# Altium schematic sheet Supply.SchDoc
size Letter
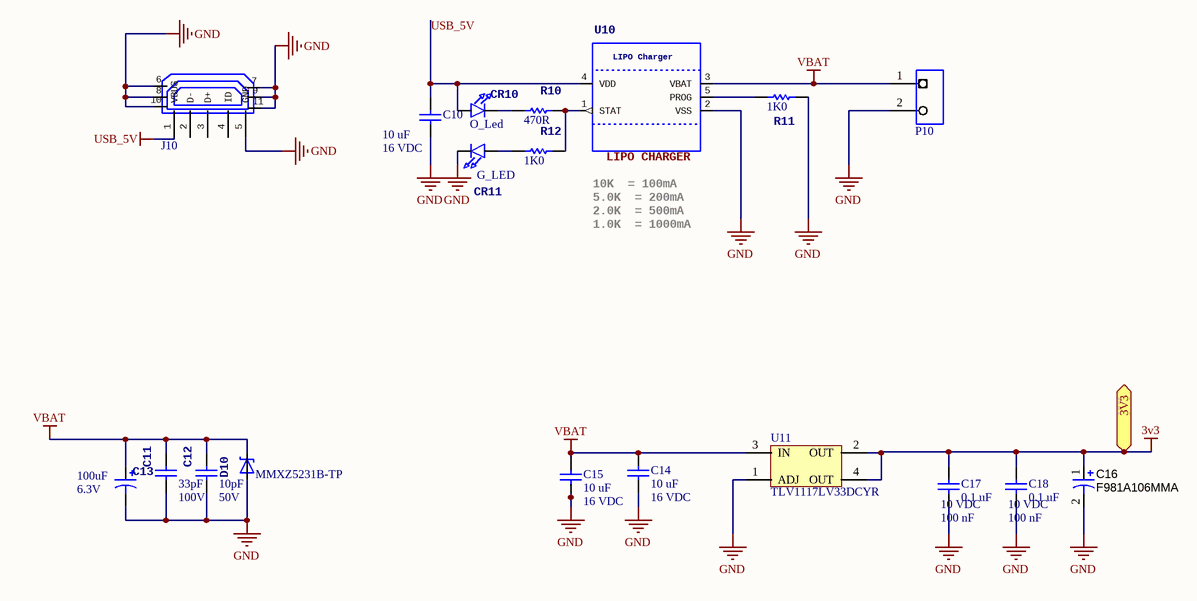
[diagram p0: Supply.SchDoc]

## Parts
C10  Capacitance: 10 uF  Voltage Rating DC: 16 VDC  [C0603]  (hidden comment: EMK107BBJ106MA-T)
C11  Capacitance: 33pF  Voltage Rating: 100V  [0805-C]  (hidden comment: 08051A330JAT2A)
C12  Capacitance: 10pF  Voltage Rating: 50V  [0805-C]  (hidden comment: 04025A100JAT2A)
C13  Capacitance: 100uF  Voltage Rating: 6.3V  [C1210]  (hidden comment: C3225X6S0J107M250AC)
C14  Capacitance: 10 uF  Voltage Rating DC: 16 VDC  [C0603]  (hidden comment: EMK107BBJ106MA-T)
C15  Capacitance: 10 uF  Voltage Rating DC: 16 VDC  [C0603]  (hidden comment: EMK107BBJ106MA-T)
C16  F981A106MMA  [C0603_P]
C17  Capacitance: 0.1 uF  Voltage Rating DC: 10 VDC  Capacitance - nF: 100 nF  [C0402]  (hidden comment: 100 nF, 10 V)
C18  Capacitance: 0.1 uF  Voltage Rating DC: 10 VDC  Capacitance - nF: 100 nF  [C0402]  (hidden comment: 100 nF, 10 V)
CR10  Product: O_Led  [0402-LED_RED]  (hidden comment: Led_Orange_0402)
CR11  Product: G_LED  [0402-LED_GRE]  (hidden comment: SML-P11MTT86R)
D10  Manufacturer Part Number: MMXZ5231B-TP  [SOD-123]  (hidden comment: MMSZ5231BT1G)
J10  1981568-1  [TYCO_19815681N]  (value not drawn)
P10  header  [HDR1X2]  (value not drawn)
R10  Resistance: 470R  [0805-R]  (hidden comment: CRCW0805470RJNEA)
R11  Resistance: 1K0  [0805-R]  (hidden comment: CRCW08051K00JNEB)
R12  Resistance: 1K0  [0805-R]  (hidden comment: CRCW08051K00JNEB)
U10  MCP73831T-2ACI/OT  [SOT23-5]  (value not drawn)
U11  TLV1117LV33DCYR  [SOT230P700X180-4AN]

## Ports
3V3 (out)

## Nets
3v3: C16.1(+) C17.1 C18.1 U11.2(OUT) U11.4(OUT) ; port 3V3
GND: C10.2 C11.2 C12.2 C13.2(-) C14.2 C15.2 C16.2(-) C17.2 C18.2 CR11.K D10.A J10.5(GND) J10.6 J10.7 J10.8 J10.9 J10.10 J10.11 P10.2 R11.2 U10.2(VSS) U11.1(ADJ)
USB_5V: C10.1 CR10.A J10.1(VBUS) U10.4(VDD)
VBAT: C11.1 C12.1 C13.1(+) C14.1 C15.1 D10.C P10.1 U10.3(VBAT) U11.3(IN)
NetCR10_K: CR10.K R10.1
NetCR11_A: CR11.A R12.1
NetR10_2: R10.2 R12.2 U10.1(STAT)
NetR11_1: R11.1 U10.5(PROG)

Not connected (* = marked no-connect by the designer): J10 2(D-) 3(D+) 4(ID)

## Notes on the sheet
- LIPO CHARGER
- 10K  = 100mA
- 5.0K  = 200mA
- 2.0K  = 500mA
- 1.0K  = 1000mA
- Proyecto:
- CENTRO DE INGENIERIA Y DESARROLLO INDUSTRIAL
- Titulo:
- Fecha:
- Hoja:
- Elaborado por:
- de
- Hora:
- Revisión:
- Revisado por:
- CIDESI_template_letter

## Library data of the parts
C10 C14 C15 = 10 uF, 16 V: Cap_Cer; Manufacturer: Taiyo Yuden; Tolerance: 20 %; Type: General Purpose; Class: Class 2; Dielectric: X5R; Supplier 1: Mouser; Manufacturer Part Number: EMK107BBJ106MA-T; RoHS: RoHS Compliant; Category: Multilayer Ceramic Capacitors MLCC - SMD/SMT; Stock 1: 78303; Pricing 1: 1=0.530, 10=0.278, 100=0.163, 500=0.126, 1000=0.100, 4000=0.100 (USD); Diameter: -; Height: 0.8 mm; Length: 1.6 mm; Package / Case: 0603 (1608 metric); Packaging: Reel; Product: General Type MLCCs; Series: M; Termination Style: SMD/SMT; Width: 0.8 mm; Brand: Taiyo Yuden; Case Code - in: 0603; Case Code - mm: 1608; Maximum Operating Temperature: + 85 C; Minimum Operating Temperature: - 55 C; Standard Pack Qty: 4000; Termination: -; RoHS - Mouser: Y; Minimum Order Quantity: 1; Reeling: True; ComponentLink1URL: http://www.mouser.com/ds/2/396/mlcc11_hq_e-541564.pdf; ComponentLink1Description: http://www.mouser.com/ds/2/396/mlcc11_hq_e-541564.pdf; Supplier Part Number 1: 963-EMK107BBJ106MA-T
C11 = 33pF, 100V: Cap_Cer; Manufacturer: AVX; Ceramic Capacitor Case: 0805 [2012 Metric]; Capacitance Tolerance: 5%; Dielectric Characteristic: C0G / NP0; Supplier 1: Newark; Manufacturer Part Number: 08051A330JAT2A; RoHS: YES; Stock 1: 2874; Pricing 1: 1=0.012, 25=0.012, 50=0.012, 100=0.012, 250=0.012, 500=0.012, 1000=0.012, 2500=0.012 (USD); Product Range: -; Packaging: Cut Tape; ComponentLink1URL: http://www.avx.com/docs/Catalogs/cpack.pdf; ComponentLink1Description: http://www.avx.com/docs/Catalogs/cpack.pdf; ComponentLink2URL: http://www.farnell.com/cad/1614359.zip; ComponentLink2Description: http://www.farnell.com/cad/1614359.zip; ComponentLink3URL: http://www.farnell.com/datasheets/2068140.pdf; ComponentLink3Description: http://www.farnell.com/datasheets/2068140.pdf; Supplier Part Number 1: 96K4771
C12 = 10pF, 50V: Cap_Cer; Manufacturer: AVX; Ceramic Capacitor Case: 0402 [1005 Metric]; Capacitance Tolerance: 5%; Dielectric Characteristic: C0G / NP0; Supplier 1: Newark; Manufacturer Part Number: 04025A100JAT2A; RoHS: YES; Stock 1: 235697; Pricing 1: 1=0.003, 25=0.003, 100=0.003, 250=0.003, 500=0.003, 1000=0.003, 2500=0.003 (USD); Product Range: -; Packaging: Cut Tape; ComponentLink1URL: http://www.farnell.com/datasheets/2068140.pdf; ComponentLink1Description: http://www.farnell.com/datasheets/2068140.pdf; Supplier Part Number 1: 96M1128
C13 = 100uF, 6.3V: Cap_Pol; Manufacturer: TDK; Ceramic Capacitor Case: 1210 [3225 Metric]; Capacitance Tolerance: 20%; Dielectric Characteristic: X6; Product Range: C Series; Supplier 1: Newark; Manufacturer Part Number: C3225X6S0J107M250AC; RoHS: YES; Stock 1: 1165; Pricing 1: 1=2.09, 10=1.72, 25=1.48, 50=1.24, 100=1.01, 250=0.95, 500=0.897 (USD); Packaging: Cut Tape; ComponentLink1URL: http://bcove.me/dwwzmldz; ComponentLink1Description: http://bcove.me/dwwzmldz; ComponentLink2URL: http://www.farnell.com/datasheets/2291921.pdf; ComponentLink2Description: http://www.farnell.com/datasheets/2291921.pdf; Supplier Part Number 1: 78Y7998
C16 = 10UF, 10V, C_TAN: CAP_TAN; Manufacturer 1: NICHICON; Value: 10 uF; Product Range: NICHICON - F98 Series; Capacitance: 10; Capacitance Tolerance: ± 20%; Capacitor Case Style: 0603 ^1608 Metric]; ESR: 7.5; Description 1: NICHICON - F981A106MMA - CAPACITOR TANT, 10UF, 10V 20%; Supplier 1: Farnell; Stock 1: 9201; Pricing 1: 1=0.282, 10=0.236, 100=0.169, 250=0.148, 500=0.131, 1000=0.117 (GBP); Voltage Rating: 10; Operating Temperature Max: 125; Series: F98; ComponentLink1URL: http://www.nichicon.co.jp/english/products/pdfs/e-f98.pdf; ComponentLink1Description: http://www.nichicon.co.jp/english/products/pdfs/e-f98.pdf; Supplier Part Number 1: 1853431; Manufacturer Part Number 1: F981A106MMA; RoHS 1: YES; Manufacturer Part Number: F981A106MMA
C17 C18 = 100 nF, 10 V: Cap_Cer; Manufacturer: Murata Electronics; Manufacturer Part Number: GRM155R71A104KA01D; Tolerance: 10 %; Type: General Purpose MLCC; Capacitance - pF: 100000 pF; Dielectric: X7R; Qualification: Commercial; Supplier 1: Mouser; RoHS: RoHS Compliant; Stock 1: 259611; Pricing 1: 1=0.100, 10=0.006, 100=0.004, 500=0.003, 10000=0.003 (USD); Packaging: Reel; ComponentLink1URL: http://www.mouser.com/ds/2/281/c02e-2905.pdf; ComponentLink1Description: http://www.mouser.com/ds/2/281/c02e-2905.pdf; Supplier Part Number 1: 81-GRM155R71A104KA1D; Category: Multilayer Ceramic Capacitors MLCC - SMD/SMT; Height: 0.5 mm; Length: 1 mm; Package / Case: 0402 (1005 metric); Product: General Type MLCCs; Series: GRM; Termination Style: SMD/SMT; Width: 0.5 mm; Brand: Murata Electronics; Case Code - in: 0402; Case Code - mm: 1005; Maximum Operating Temperature: + 125 C; Minimum Operating Temperature: - 55 C; Standard Pack Qty: 10000; RoHS - Mouser: Y; Minimum Order Quantity: 1; Reeling: True
CR10 = Led_Orange_0402: Led_Orange; Manufacturer: ROHM Semiconductor; Manufacturer Part Number: SML-P12DTT86R; Illumination Color: Orange; Luminous Intensity: 100 mcd; If - Forward Current: 20 mA; Lens Transparency: Water Clear; Vf - Forward Voltage: 2.1 V; Wavelength/Color Temperature: 605 nm; Supplier 1: Mouser; RoHS: RoHS Compliant; Category: Standard LEDs - SMD; Stock 1: 22469; Pricing 1: 1=0.546, 10=0.347, 100=0.150, 1000=0.114, 5000=0.087 (MXN); Length: 1 mm; Orientation: Top View; Package / Case: 0402 (1005 metric); Packaging: Cut Tape; Series: SML-P1x; Width: 0.6 mm; Brand: ROHM Semiconductor; Mounting Style: SMD/SMT; Viewing Angle: -; Maximum Operating Temperature: + 85 C; Minimum Operating Temperature: - 40 C; Moisture Sensitive: Yes; Product Type: LED - Standard; Standard Pack Qty: 5000; Subcategory: LEDs; Tradename: PICOLED; RoHS - Mouser: Y; Minimum Order Quantity: 1; Reeling: True; ComponentLink1URL: https://www.mouser.com/datasheet/2/348/sml-p1-e-1809025.pdf; ComponentLink1Description: https://www.mouser.com/datasheet/2/348/sml-p1-e-1809025.pdf; Supplier Part Number 1: 755-SML-P12DTT86R
CR11 = Led_Green_0402: Led_Green; Manufacturer: ROHM Semiconductor; Illumination Color: Green; Luminous Intensity: 2.1 mcd; If - Forward Current: 1 mA; Lens Transparency: Water Clear; Vf - Forward Voltage: 1.9 V; Wavelength/Color Temperature: 569 nm; Supplier 1: Mouser; Manufacturer Part Number: SML-P11MTT86R; RoHS: RoHS Compliant; Category: Standard LEDs - SMD; Stock 1: 15242; Pricing 1: 1=0.585, 10=0.376, 100=0.161, 1000=0.124, 5000=0.094 (MXN); Length: 1 mm; Orientation: Top View; Package / Case: 0402 (1006 metric); Packaging: Cut Tape; Series: SML-P11; Width: 0.6 mm; Brand: ROHM Semiconductor; Mounting Style: SMD/SMT; Viewing Angle: -; Maximum Operating Temperature: + 85 C; Minimum Operating Temperature: - 40 C; Moisture Sensitive: Yes; Product Type: LED - Standard; Standard Pack Qty: 5000; Subcategory: LEDs; Tradename: PICOLED; RoHS - Mouser: Y; Minimum Order Quantity: 1; Reeling: True; ComponentLink1URL: https://www.mouser.com/datasheet/2/348/sml-p11-e-1139217.pdf; ComponentLink1Description: https://www.mouser.com/datasheet/2/348/sml-p11-e-1139217.pdf; Supplier Part Number 1: 755-SML-P11MTT86R
D10 = Diode_Zener: Manufacturer: MICRO COMMERCIAL COMPONENTS; Zener Voltage Vz Typ: 5.1; Power Dissipation Pd: 200; Diode Case Style: SOD-323; Zener Tolerance: 5%; No. of Pins: 2; Supplier 1: Newark; RoHS: YES; Stock 1: 410; Pricing 1: 1=0.602, 10=0.434, 100=0.256, 250=0.181, 500=0.139, 1000=0.098, 5000=0.082, 10000=0.07 (USD); Operating Temperature Max: 150 C; Product Range: -; Packaging: Cut Tape; ComponentLink1URL: http://61.222.192.61/mccsemi/up_pdf/Product%20Packaging.pdf; ComponentLink1Description: http://61.222.192.61/mccsemi/up_pdf/Product%20Packaging.pdf; ComponentLink2URL: http://www.farnell.com/datasheets/1699886.pdf; ComponentLink2Description: http://www.farnell.com/datasheets/1699886.pdf; Supplier Part Number 1: 51T4940
J10 = USB: Micro USB; Manufacturer: AMP - TE CONNECTIVITY; Supplier 1: Newark; Manufacturer Part Number: 1981568-1; Stock 1: 1013; Pricing 1: 1=1.39, 10=1.39, 25=1.39, 50=1.29, 100=1.29, 250=1.29, 500=1.29 (USD); ComponentLink1URL: http://www.farnell.com/datasheets/1650952.pdf; ComponentLink1Description: http://www.farnell.com/datasheets/1650952.pdf; ComponentLink2URL: http://www.farnell.com/datasheets/1654342.pdf; ComponentLink2Description: http://www.farnell.com/datasheets/1654342.pdf; ComponentLink3URL: http://www.farnell.com/cad/1957472.pdf; ComponentLink3Description: http://www.farnell.com/cad/1957472.pdf; ComponentLink4URL: https://players.brightcove.net/1362235890001/BJ9h2Pe9_default/index.html?videoId=5970358614001; ComponentLink4Description: https://players.brightcove.net/1362235890001/BJ9h2Pe9_default/index.html?videoId=5970358614001; ComponentLink5URL: https://players.brightcove.net/1362235890001/BJ9h2Pe9_default/index.html?videoId=5970358640001; ComponentLink5Description: https://players.brightcove.net/1362235890001/BJ9h2Pe9_default/index.html?videoId=5970358640001; ComponentLink6URL: https://players.brightcove.net/1362235890001/BJ9h2Pe9_default/index.html?videoId=5970356014001; ComponentLink6Description: https://players.brightcove.net/1362235890001/BJ9h2Pe9_default/index.html?videoId=5970356014001; Supplier Part Number 1: 73M8666
P10 = header: Bateria; Manufacturer Part Number: No aplica
R10 = 470R0, 125mW: Resistor; Manufacturer: VISHAY; Supplier 1: Newark; Manufacturer Part Number: CRCW0805470RJNEA; RoHS: YES; Stock 1: 1520; Pricing 1: 1=0.131, 25=0.055, 50=0.043, 100=0.032, 250=0.032, 500=0.03, 1000=0.023 (USD); ComponentLink1URL: http://www.vishay.com/docs/20014/smdpack.pdf; ComponentLink1Description: http://www.vishay.com/docs/20014/smdpack.pdf; ComponentLink2URL: http://www.farnell.com/cad/1552941.zip; ComponentLink2Description: http://www.farnell.com/cad/1552941.zip; ComponentLink3URL: http://www.farnell.com/datasheets/2111203.pdf?_ga=1.39057253.733356815.1493180800; ComponentLink3Description: http://www.farnell.com/datasheets/2111203.pdf?_ga=1.39057253.733356815.1493180800; Supplier Part Number 1: 59M8584
R11 R12 = 1K0, 125mW: Resistor; Manufacturer: VISHAY; Voltage Rating: 150V; Resistor Case Style: 0805 [2012 Metric]; Power Rating: 125; Resistance Tolerance: 5%; Product Range: CRCW Series; Supplier 1: Newark; Manufacturer Part Number: CRCW08051K00JNEB; RoHS: YES; Stock 1: 2322; Pricing 1: 1=0.004, 25=0.004, 100=0.004 (USD); Packaging: Cut Tape; MSL: MSL 1 - Unlimited; ComponentLink1URL: http://www.vishay.com/docs/20014/smdpack.pdf; ComponentLink1Description: http://www.vishay.com/docs/20014/smdpack.pdf; ComponentLink2URL: http://www.farnell.com/cad/1552627.zip; ComponentLink2Description: http://www.farnell.com/cad/1552627.zip; ComponentLink3URL: http://www.farnell.com/datasheets/2111203.pdf?_ga=1.39057253.733356815.1493180800; ComponentLink3Description: http://www.farnell.com/datasheets/2111203.pdf?_ga=1.39057253.733356815.1493180800; Supplier Part Number 1: 65J1337
U10 = MCP73831/2: Charger; Manufacturer: MICROCHIP; Battery Type: Li-Ion, Li-Pol; Input Voltage: 6; Battery Charge Voltage: 4.2; Charge Current Max: 500; Battery IC Case Style: SOT-23; No. of Pins: 5; No. of Series Cells: 1; Supplier 1: Newark; Manufacturer Part Number: MCP73831T-2ACI/OT; RoHS: YES; Stock 1: 3000; Pricing 1: 3000=0.619 (USD); Packaging: Tape & Reel; ComponentLink1URL: http://www.farnell.com/cad/1545964.zip; ComponentLink1Description: http://www.farnell.com/cad/1545964.zip; ComponentLink2URL: http://www.farnell.com/datasheets/2124927.pdf; ComponentLink2Description: http://www.farnell.com/datasheets/2124927.pdf; ComponentLink3URL: http://www.farnell.com/datasheets/2338016.pdf; ComponentLink3Description: http://www.farnell.com/datasheets/2338016.pdf; MCP73831/2: MCP73831/2; Temp:: Temp:; -40-85°C: -40-85°C; VDD:: VDD:; 3.75-6V: 3.75-6V; Supplier Part Number 1: 28X3685; LIPO Charger: LIPO Charger
U11 = IC,LDO,3V3,1A,TLV1117LV: Regulador3V3; Manufacturer: TEXAS INSTRUMENTS; Output Type: Fixed; Input Voltage Min: 2; Input Voltage Max: 5.5; Fixed Output Voltage Nom.: 3.3; Output Current: 1; Supplier 1: Newark; RoHS: YES; Stock 1: 547; Pricing 1: 1=0,618, 10=0,515, 100=0,332, 1000=0,266 (USD); Adjustable Output Voltage Min: -; Adjustable Output Voltage Max: -; ComponentLink1URL: http://www.farnell.com/simulation/1746677.zip; ComponentLink1Description: http://www.farnell.com/simulation/1746677.zip; ComponentLink2URL: http://www.ti.com/general/docs/lit/getliterature.tsp?genericPartNumber=TLV1117LV&amp;&amp;fileType=pdf; ComponentLink2Description: http://www.ti.com/general/docs/lit/getliterature.tsp?genericPartNumber=TLV1117LV&amp;&amp;fileType=pdf; Supplier Part Number 1: 48T4644; Manufacturer Part Number: TLV1117LV33DCYR